# EAGLE design K3NG Rotator Interface V2 (EAGLE 6.2)
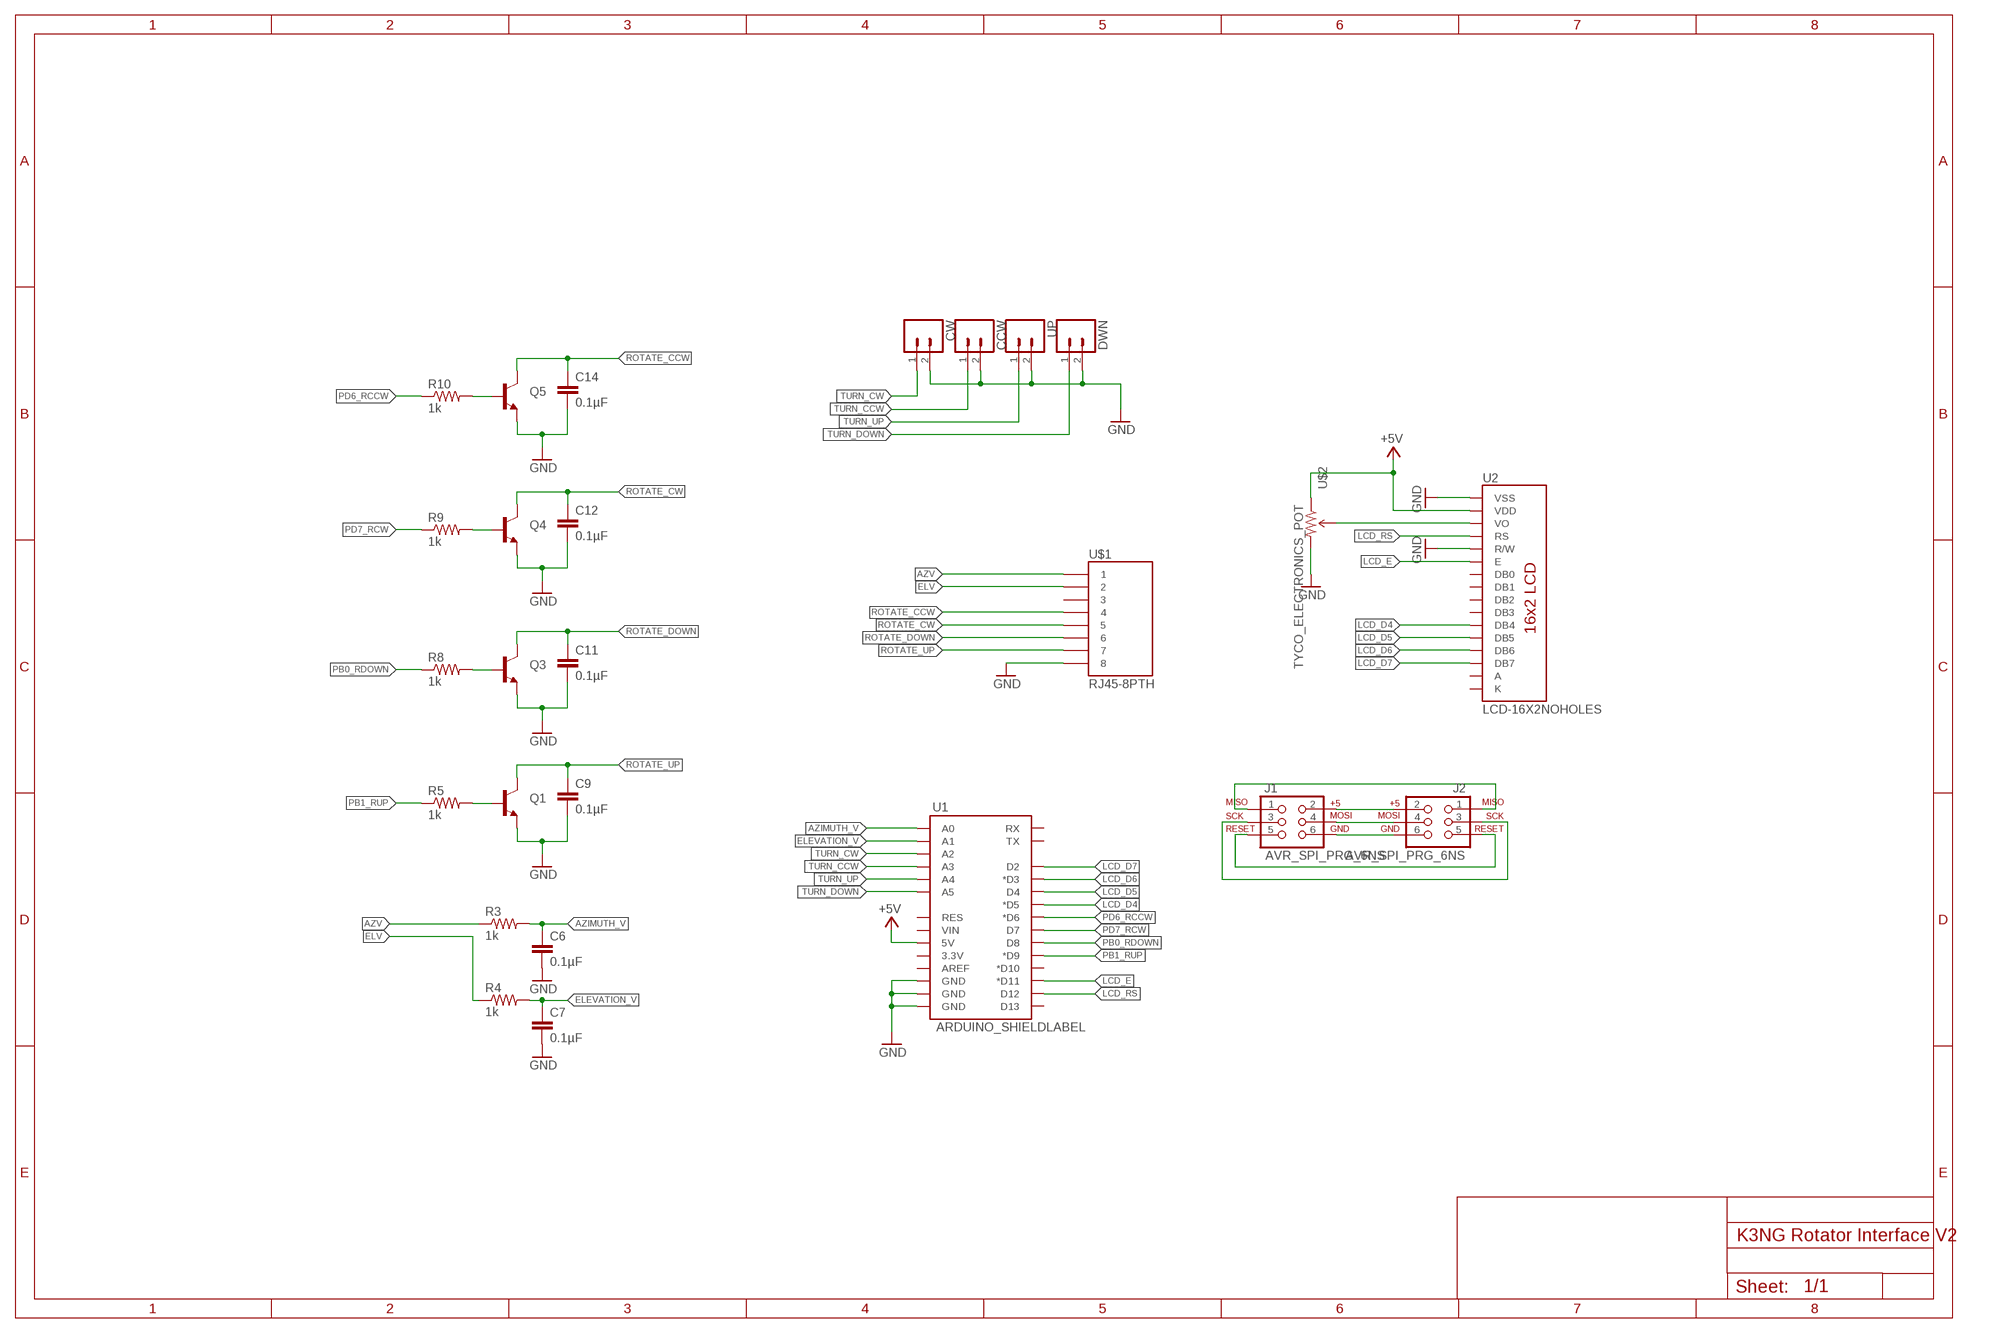
[diagram p0: schematic, sheet 1]

## Parts
C6  0.1µF  CAP0603-CAP  [0603-CAP]
C7  0.1µF  CAP0603-CAP  [0603-CAP]
C9  0.1µF  CAP0603-CAP  [0603-CAP]
C11  0.1µF  CAP0603-CAP  [0603-CAP]
C12  0.1µF  CAP0603-CAP  [0603-CAP]
C14  0.1µF  CAP0603-CAP  [0603-CAP]
CCW  M02PTH  [1X02]
CW  M02PTH  [1X02]
DWN  M02PTH  [1X02]
J1  AVR_SPI_PRG_6NS  [2X3-NS]
J2  AVR_SPI_PRG_6NS  [2X3-NS]
Q1  TRANSISTOR_NPNSOT23  [SOT23]
Q3  TRANSISTOR_NPNSOT23  [SOT23]
Q4  TRANSISTOR_NPNSOT23  [SOT23]
Q5  TRANSISTOR_NPNSOT23  [SOT23]
R3  1k  RESISTOR0805-RES  [0805]
R4  1k  RESISTOR0805-RES  [0805]
R5  1k  RESISTOR0805-RES  [0805]
R8  1k  RESISTOR0805-RES  [0805]
R9  1k  RESISTOR0805-RES  [0805]
R10  1k  RESISTOR0805-RES  [0805]
U1  ARDUINO_SHIELDLABEL  [DUEMILANOVE_SHIELD]
U2  LCD-16X2NOHOLES  [LCD-16X2_NOHOLES]
U$1  RJ45-8PTH  [RJ45-8]
U$2  TYCO_ELECTRONICS_POT  [TYCO_ELECTRONICS_POT]
UP  M02PTH  [1X02]

## Nets
+5V [usbvcc]: U1.5V U2.2(VDD) U$2.P$1(CCW)
AZIMUTH_V: C6.1 R3.2 U1.A0
AZV: R3.1 U$1.1
ELEVATION_V: C7.1 R4.2 U1.A1
ELV: R4.1 U$1.2
GND [gnd]: C6.2 C7.2 C9.2 C11.2 C12.2 C14.2 CCW.2 CW.2 DWN.2 Q1.2(E) Q3.2(E) Q4.2(E) Q5.2(E) U1.GND@0(GND) U1.GND@1(GND) U1.GND@2(GND) U2.1(VSS) U2.5(R/W) U$1.8 U$2.P$3(CW) UP.2
LCD_D4: U1.D5(*D5) U2.11(DB4)
LCD_D5: U1.D4 U2.12(DB5)
LCD_D6: U1.D3(*D3) U2.13(DB6)
LCD_D7: U1.D2 U2.14(DB7)
LCD_E: U1.D11(*D11) U2.6(E)
LCD_RS: U1.D12 U2.4(RS)
N$1: J1.2 J2.2
N$2: J1.4 J2.4
N$3: J1.6 J2.6
N$4: J1.1 J2.1
N$5: J1.5 J2.5
N$6: J1.3 J2.3
N$12: Q1.1(B) R5.2
N$16: Q3.1(B) R8.2
N$17: U2.3(VO) U$2.P$2(WIPER)
N$19: Q4.1(B) R9.2
N$22: Q5.1(B) R10.2
PB0_RDOWN: R8.1 U1.D8
PB1_RUP: R5.1 U1.D9(*D9)
PD6_RCCW: R10.1 U1.D6(*D6)
PD7_RCW: R9.1 U1.D7
ROTATE_CCW: C14.1 Q5.3(C) U$1.4
ROTATE_CW: C12.1 Q4.3(C) U$1.5
ROTATE_DOWN: C11.1 Q3.3(C) U$1.6
ROTATE_UP: C9.1 Q1.3(C) U$1.7
TURN_CCW: CCW.1 U1.A3
TURN_CW: CW.1 U1.A2
TURN_DOWN: DWN.1 U1.A5
TURN_UP: U1.A4 UP.1
Unconnected: U1.3.3V U1.AREF U1.D10(*D10) U1.D13 U1.RES U1.RX U1.TX U1.VIN U2.7(DB0) U2.8(DB1) U2.9(DB2) U2.10(DB3) U$1.3

## Power pins joined to a net without a drawn wire
A: U2.15(A)
K: U2.16(K)

## Library data of the parts
C6 C7 C9 C11 C12 C14 = SparkFun:CAP: Capacitor Standard 0603 ceramic capacitor, and 0.1" leaded capacitor.
CCW CW DWN UP = SparkFun:M02: Header 2 Standard 2-pin 0.1" header. Use with straight break away headers (SKU : PRT-00116), right angle break away headers (PRT-00553), swiss pins (PRT-00743), machine pins (PRT-00117), and female headers (PRT-00115). Molex polarized connector foot print use with SKU : PRT-08233 with associated crimp pins and housings.
J1 J2 = SparkFun:AVR_SPI_PRG_6: AVR ISP 6 Pin This is the reduced ISP connector for AVR programming. Common on Arduino. This footprint will take up less PCB space and can be used with a 10-pin to 6-pin adapter such as SKU: BOB-08508
Q1 Q3-Q5 = SparkFun:TRANSISTOR_NPN: Transistor NPN BJT configuration in SOT23 package. MMBT2222 is the common NPN we use. Double check BCE configuration again layout.
R3-R5 R8-R10 = SparkFun:RESISTOR: Resistor Basic schematic elements and footprints for 0603, 1206, and PTH resistors.
U1 = SparkFun:ARDUINO_SHIELD
U2 = SparkFun:LCD-16X2
U$1 = SparkFun:RJ45-8: RJ45 Jack Simple RJ45, 8-pin connection - connector for common Cat5, Cat5e, and Cat6 Ethernet cables. Footprint not yet proven in production. Connector sku is PRT-00643; Breakout PCB sku is BOB-00716.
U$2 = Ava:TYCO_ELECTRONICS_POT

## Net classes
0 default: width 0.254 mm, drill 0.305 mm, clearance 0.152 mm
2 gnd: width 0.305 mm, drill 0.508 mm, clearance 0.152 mm
3 usbvcc: width 0.508 mm, drill 0.508 mm, clearance 0.152 mm
4 aref: width 0.406 mm

## Board
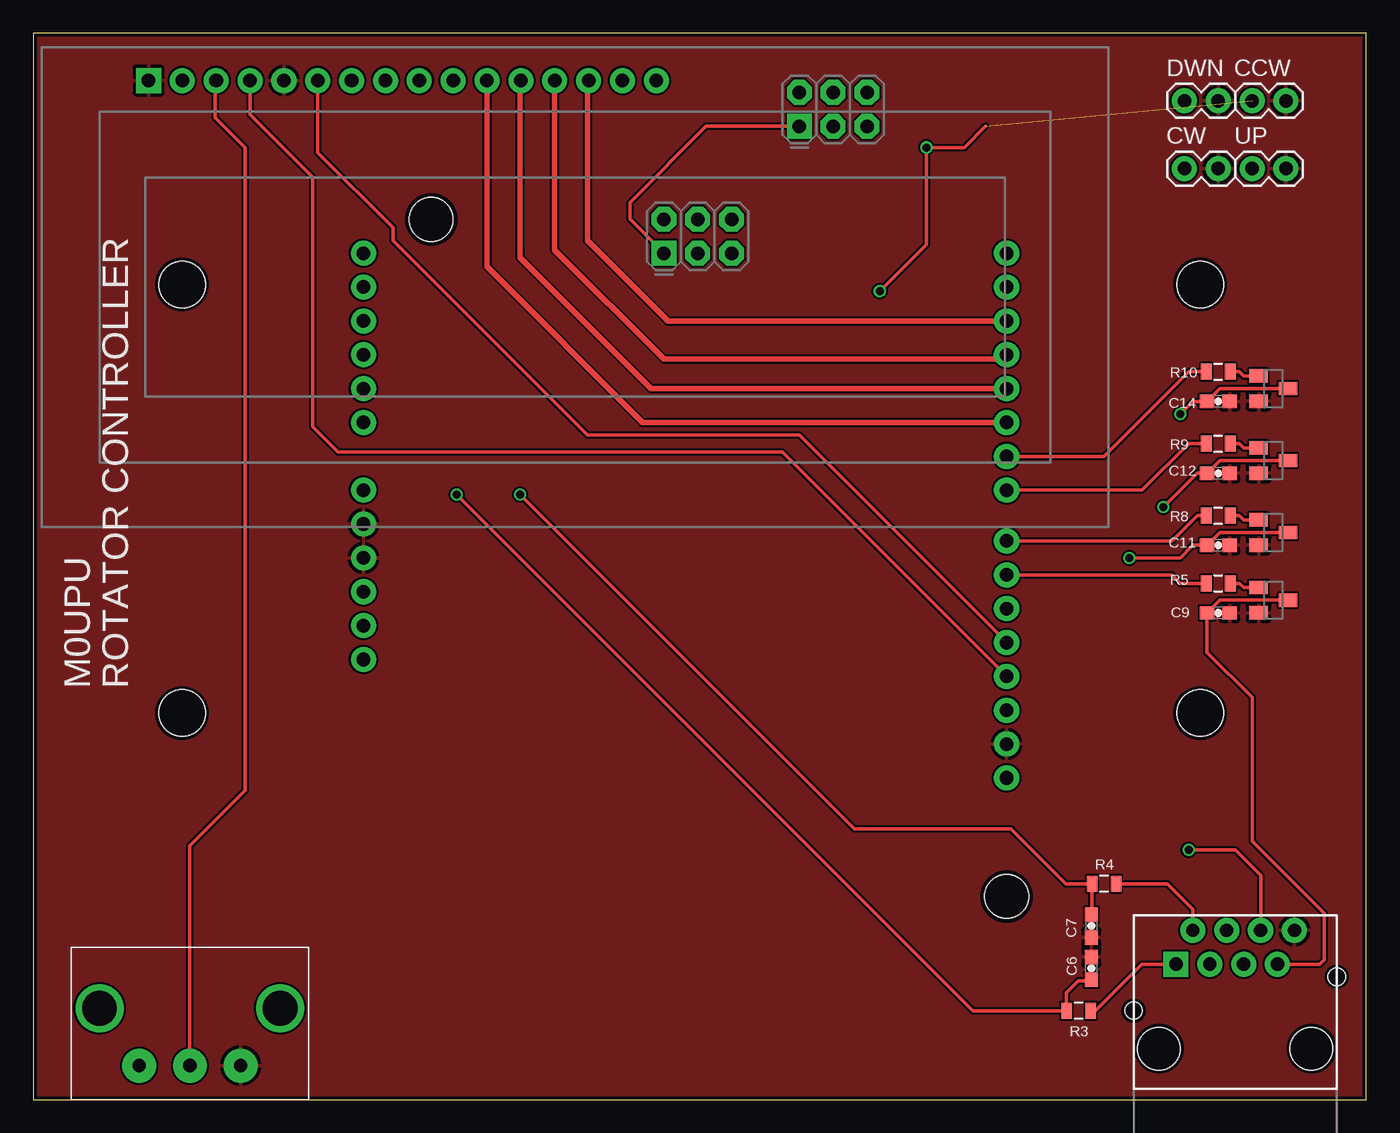
[diagram p1: board, top side]
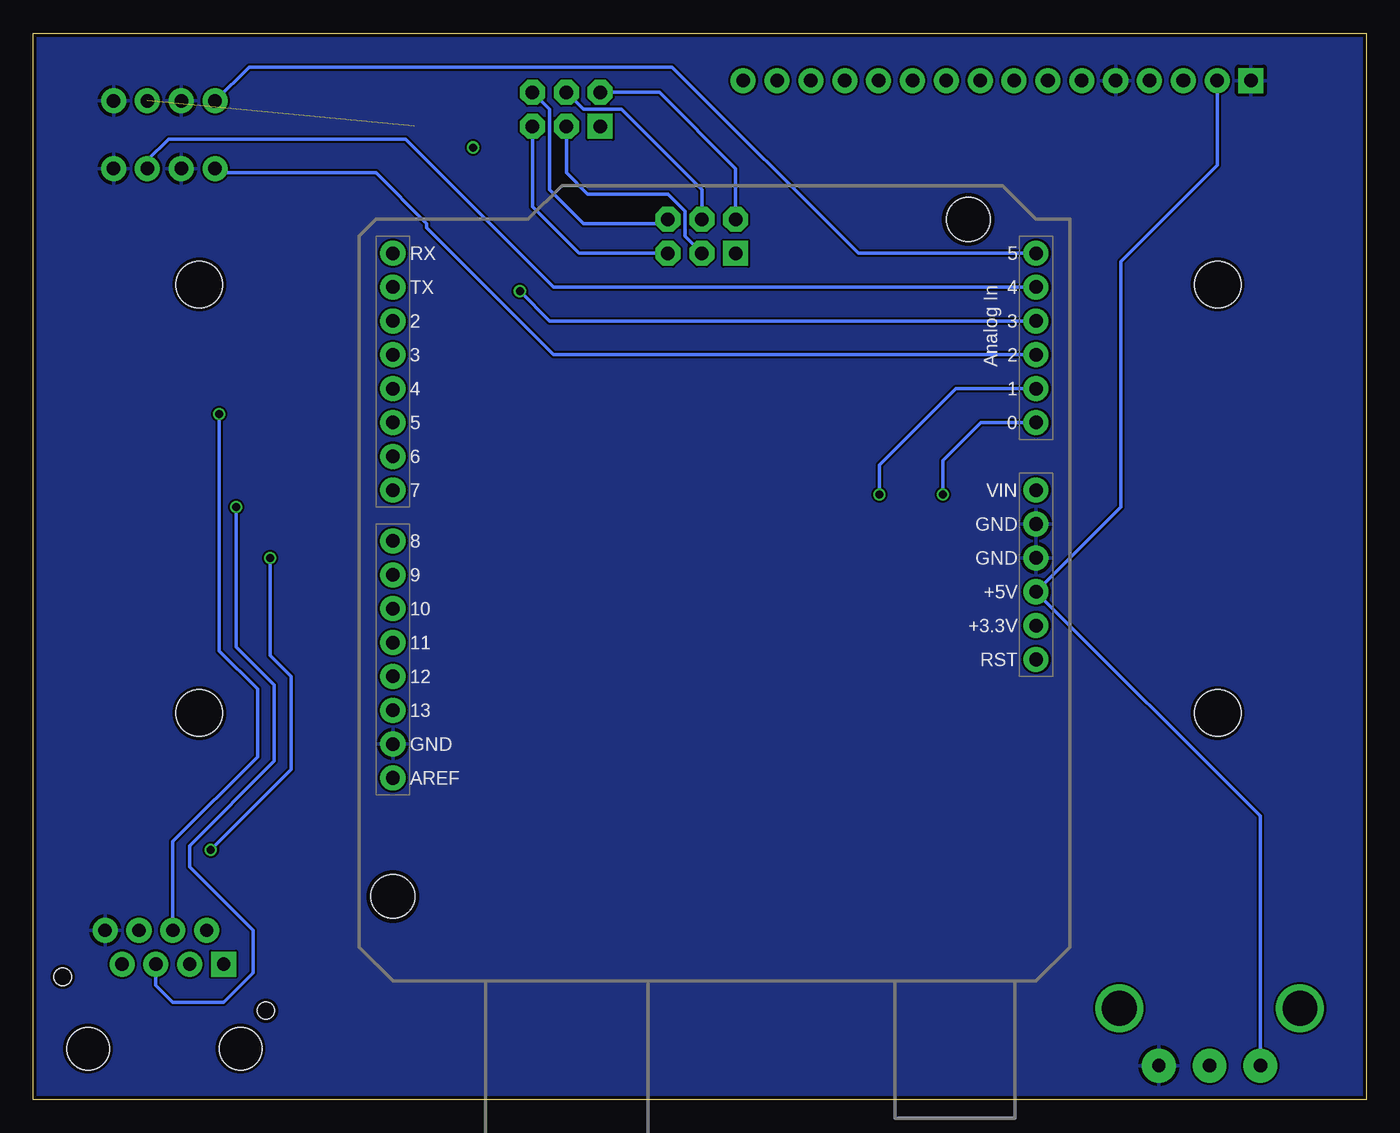
[diagram p2: board, bottom side, seen from below]

Size 100 x 80 mm. Coordinates in mm from the lower left corner, seen from the top.
Outline: 0,0 100,0 100,80 0,80 0,0
Copper layers (1*16): Top 0.035mm / dielectric 1.5mm / Bottom 0.035mm
Design rules: minimum track width 6mil, minimum drill 12mil, track to track 6mil, track to pad 6mil, pad to pad 6mil, via to via 6mil, smd to smd 0mil, copper to edge 10mil, drill to drill 10mil, minimum pad ring 10mil, minimum via ring 6mil, stop-mask expansion 2mil, vias tented up to drill 100mil, thermal gap 10mil
Holes 3.5 mm at 11.15,29 87.55,29 11.15,61.15 87.55,61.15
Holes 1.3 mm at 97.79,9.21 82.55,6.67

### Footprints (pad centres in the part's own frame; a part is rotated, then mirrored left to right if it is on the bottom)
0603-CAP = smd 1.1 x 1: 1 -0.85,0; 2 0.85,0
1X02 = drill 1.016 pad 1.88: 1 0,0; 2 2.54,0
2X3-NS = drill 1.016 pad 1.88 square: 1 -2.54,-1.27 | drill 1.016 pad 1.88 octagon: 2 -2.54,1.27; 3 0,-1.27; 4 0,1.27; 5 2.54,-1.27; 6 2.54,1.27
SOT23 = smd 1 x 1.4: 1 -0.95,-1.1; 2 0.95,-1.1; 3 0,1.1
0805 = smd 0.8 x 1.2: 1 -0.9,0; 2 0.9,0
DUEMILANOVE_SHIELD = drill 1.016 pad 1.88: 3.3V 50.8,26.67; 5V 50.8,29.21; A0 50.8,41.91; A1 50.8,44.45; A2 50.8,46.99; A3 50.8,49.53; A4 50.8,52.07; A5 50.8,54.61; AREF 2.54,15.24; D2 2.54,49.53; D3 2.54,46.99; D4 2.54,44.45; D5 2.54,41.91; D6 2.54,39.37; D7 2.54,36.83; D8 2.54,33.02; D9 2.54,30.48; D10 2.54,27.94; D11 2.54,25.4; D12 2.54,22.86; D13 2.54,20.32; GND@0 50.8,31.75; GND@1 50.8,34.29; GND@2 2.54,17.78; RES 50.8,24.13; RX 2.54,54.61; TX 2.54,52.07; VIN 50.8,36.83 | hole 3.302: 45.72,57.15; 2.54,6.35
LCD-16X2_NOHOLES = drill 1.016 pad 1.88 square: 1 -32,15.5 | drill 1.016 pad 1.88: 2 -29.46,15.5; 3 -26.92,15.5; 4 -24.38,15.5; 5 -21.84,15.5; 6 -19.3,15.5; 7 -16.76,15.5; 8 -14.22,15.5; 9 -11.68,15.5; 10 -9.14,15.5; 11 -6.6,15.5; 12 -4.06,15.5; 13 -1.52,15.5; 14 1.02,15.5; 15 3.56,15.5; 16 6.1,15.5
RJ45-8 = drill 1 pad 1.88 square: 1 -4.445,6.35 | drill 1 pad 1.88: 2 -3.175,8.89; 3 -1.905,6.35; 4 -0.635,8.89; 5 0.635,6.35; 6 1.905,8.89; 7 3.175,6.35; 8 4.445,8.89 | hole 3.2: -5.715,0; 5.715,0
TYCO_ELECTRONICS_POT = drill 1 pad 2.54: P$1 -3.81,0; P$2 0,0; P$3 3.81,0 | drill 2.6: P$4 -6.775,4.3; P$5 6.775,4.3

### Placement (x,y rotation side)
C6  79.38,9.84 90 top
C7  79.38,13.02 270 top
C9  88.9,36.51 0 top
C11  88.9,41.59 0 top
C12  88.9,46.99 0 top
C14  88.9,52.39 0 top
CCW  91.44,74.93 0 top
CW  86.36,69.85 0 top
DWN  86.36,74.93 0 top
J1  49.85,64.77 0 top
J2  60.01,74.3 0 top
Q1  93.03,37.47 270 top
Q3  93.03,42.55 270 top
Q4  93.03,47.94 270 top
Q5  93.03,53.34 270 top
R3  78.42,6.67 180 top
R4  80.33,16.19 180 top
R5  88.9,38.73 0 top
R8  88.9,43.81 0 top
R9  88.9,49.21 0 top
R10  88.9,54.61 0 top
U1  75.56,8.89 0 bottom
U2  40.64,60.96 0 top
U$1  90.17,3.81 0 top
U$2  11.75,2.54 0 top
UP  91.44,69.85 0 top

### Tracks (layer width: path | path; a pad name or v marks a point on that pad's centre or on a via)
+5V
  Bottom 0.254: U2.2 11.18,70.1 18.41,62.87 18.41,44.45 U1.5V 7.94,21.27 U$2.P$1
AZIMUTH_V  (via drill 0.6)
  Top 0.254: C6.1 79.27,8.89 78.42,8.89 77.52,7.99 R3.2 70.48,6.67 v31.75,45.4
  Bottom 0.254: v31.75,45.4 31.75,47.94 28.89,50.8 U1.A0
AZV
  Top 0.254: R3.1 79.69,6.67 83.19,10.16 U$1.1
ELEVATION_V  (via drill 0.6)
  Top 0.254: v36.51,45.4 61.59,20.32 73.34,20.32 77.47,16.19 R4.2 79.43,13.92 C7.1
  Bottom 0.254: v36.51,45.4 36.51,47.62 30.8,53.34 U1.A1
ELV
  Top 0.254: U$1.2 87,14.29 85.09,16.19 R4.1
GND
  pour Bottom: 0,81.28 101.6,81.28 101.6,0 0,0
  pour Top: 0,81.28 101.6,81.28 101.6,0 0,0
LCD_D4
  Top 0.406: U2.11 34.04,62.48 45.72,50.8 U1.D5
LCD_D5
  Top 0.406: U1.D4 46.35,53.34 36.51,63.18 36.51,76.39 U2.12
LCD_D6
  Top 0.406: U2.13 39.12,63.75 47.31,55.56 72.71,55.56 U1.D3
LCD_D7
  Top 0.406: U1.D2 47.62,58.42 41.59,64.45 41.59,76.39 U2.14
LCD_E
  Top 0.254: U2.6 21.34,71.05 26.99,65.41 26.99,64.45 41.59,49.85 57.47,49.85 U1.D11
LCD_RS
  Top 0.254: U2.4 16.26,73.91 20.95,69.22 20.95,50.48 22.86,48.58 56.2,48.58 U1.D12
N$1
  Bottom 0.254: J2.2 53.02,75.56 47.31,69.85 J1.2
N$2
  Bottom 0.254: J2.4 58.74,74.3 55.88,74.3 49.85,68.26 J1.4
N$3
  Bottom 0.254: J2.6 61.28,74.3 61.28,68.26 58.74,65.72 52.7,65.72 J1.6
N$4
  Top 0.254: J2.1 50.48,73.03 44.77,67.31 44.77,66.04 J1.1
N$5
  Bottom 0.254: J1.5 59.05,63.5 62.55,66.99 J2.5
N$6
  Bottom 0.254: J2.3 60.01,69.53 58.42,67.94 52.39,67.94 51.12,66.67 51.12,64.77 J1.3
N$12
  Top 0.254: R5.2 90.49,38.73 90.81,38.42 Q1.1
N$16
  Top 0.254: R8.2 90.49,43.81 90.81,43.5 Q3.1
N$17
  Top 0.254: U$2.P$2 11.75,19.05 15.88,23.18 15.88,71.44 13.65,73.66 13.65,76.39 U2.3
N$19
  Top 0.254: R9.2 90.49,49.21 90.81,48.9 Q4.1
N$22
  Top 0.254: R10.2 90.49,54.61 90.81,54.29 Q5.1
PB0_RDOWN
  Top 0.254: U1.D8 85.41,41.91 87.31,43.81 R8.1
PB1_RUP
  Top 0.254: U1.D9 85.41,39.37 86.04,38.73 R5.1
PD6_RCCW
  Top 0.254: U1.D6 80.33,48.26 86.68,54.61 R10.1
PD7_RCW
  Top 0.254: U1.D7 83.19,45.72 86.68,49.21 R9.1
ROTATE_CCW  (via drill 0.6)
  Top 0.254: Q5.3 89,53.34 C14.1 87,52.39 v86.04,51.44
  Bottom 0.254: v86.04,51.44 86.04,33.66 83.19,30.8 83.19,25.72 89.53,19.37 U$1.4
ROTATE_CW  (via drill 0.6)
  Top 0.254: Q4.3 89,47.94 C12.1 87.31,46.99 v84.77,44.45
  Bottom 0.254: v84.77,44.45 84.77,33.97 81.92,31.11 81.92,25.4 88.27,19.05 88.27,17.46 83.5,12.7 83.5,9.53 85.72,7.3 89.53,7.3 90.81,8.57 U$1.5
ROTATE_DOWN  (via drill 0.6)
  Top 0.254: Q3.3 89,42.55 C11.1 87,41.59 86.04,40.64 v82.23,40.64 | v86.68,18.73 90.17,18.73 92.08,16.83 U$1.6
  Bottom 0.254: v82.23,40.64 82.23,33.34 80.64,31.75 80.64,24.77 v86.68,18.73
ROTATE_UP
  Top 0.254: Q1.3 89,37.47 C9.1 88.05,33.55 91.44,30.16 91.44,19.37 96.84,13.97 96.84,10.48 96.52,10.16 U$1.7
TURN_CCW  (via drill 0.6)  (1 unrouted)
  Top 0.254: v63.5,60.64 66.99,64.14 v66.99,71.44 69.85,71.44 71.44,73.03
  Bottom 0.254: v63.5,60.64 61.28,58.42 U1.A3
TURN_CW
  Bottom 0.254: U1.A2 60.96,55.88 70.48,65.41 70.48,65.72 74.3,69.53 86.04,69.53 CW.1
TURN_DOWN
  Bottom 0.254: U1.A5 38.1,63.5 52.07,77.47 83.82,77.47 DWN.1
TURN_UP
  Bottom 0.254: UP.1 91.44,70.48 89.85,72.07 72.07,72.07 60.96,60.96 U1.A4

### Text on the board
tPlace: M0UPU | ROTATOR CONTROLLER